# Altium schematic sheet saw_filter_pcb.SchDoc
size A4
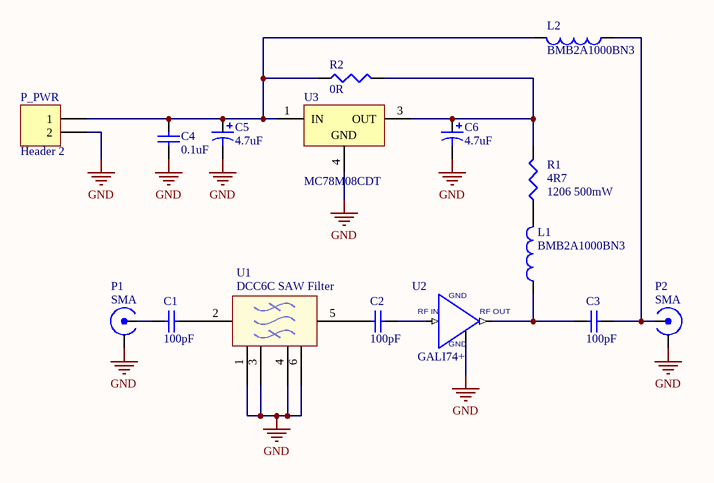
[diagram p0: saw_filter_pcb.SchDoc]

## Parts
C1  value 100pF  [1608[0603]]  (hidden comment: Cap Semi)
C2  value 100pF  [1608[0603]]  (hidden comment: Cap Semi)
C3  value 100pF  [1608[0603]]  (hidden comment: Cap Semi)
C4  value 0.1uF  [1608[0603]]  (hidden comment: Cap Semi)
C5  value 4.7uF  [C0805]  (hidden comment: Cap Pol3)
C6  value 4.7uF  [C0805]  (hidden comment: Cap Pol3)
L1  BMB2A1000BN3  [6-0805_N]
L2  BMB2A1000BN3  [6-0805_N]
P1  value SMA  [SMA_EDGE]  (hidden comment: SMA Con)
P2  value SMA  [SMA_EDGE]  (hidden comment: SMA Con)
P_PWR  Header 2  [HDR1X2]
R1  1206 500mW  value 4R7  [C1206]
R2  value 0R  [J1-0603]  (hidden comment: Res3)
U1  DCC6C SAW Filter  [DCC6C]
U2  GALI74+  [DF782]
U3  MC78M08CDT  [MP04A_N]

## Nets
GND: C4.1 C5.2 C6.2 P1.2 P2.2 P_PWR.2 U1.1(IN) U1.3(IN) U1.4(IN) U1.6(IN) U2.2(GND) U3.4(GND)
NetC1_1: C1.1 P1.1
NetC1_2: C1.2 U1.2(IN)
NetC2_1: C2.1 U1.5
NetC2_2: C2.2 U2.1(RF-IN)
NetC3_1: C3.1 L1.1 U2.3(RF-OUT)
NetC3_2: C3.2 L2.1 P2.1
NetC4_2: C4.2 C5.1 L2.2 P_PWR.1 R2.1 U3.1(IN)
NetC6_1: C6.1 R1.2 R2.2 U3.3(OUT)
NetL1_2: L1.2 R1.1

## Notes on the sheet
- (in symbol GALI74+) RF IN; RF OUT

## Library data of the parts
C1-C4 = Cap Semi: Capacitor (Semiconductor SIM Model); Published: 8-Jun-2000; LatestRevisionDate: 29-May-2009; LatestRevisionNote: IPC-7351 Footprint Added.; PackageReference: C1206; Publisher: Altium Limited; PackageDescription: Chip Capacitor
C5 C6 = Cap Pol3: Polarized Capacitor (Surface Mount); Published: 8-Jun-2000; LatestRevisionDate: 29-May-2009; LatestRevisionNote: IPC-7351 Footprint Added.; PackageReference: C0805; Publisher: Altium Limited; PackageDescription: Chip Capacitor
L1 L2 = Inductor: Code_IEC: 1005; Value: 100mH; Published: 8-Jun-2000; LatestRevisionDate: 29-May-2009; LatestRevisionNote: IPC-7351 Footprint Added.; PackageReference: 0402-A; Publisher: Altium Limited; PackageDescription: Chip Inductor; Code_JEITA: 0402
P1 P2 = SMA Con: Power Connector
P_PWR = Header 2: Header, 2-Pin; LatestRevisionDate: 17-Jul-2002; LatestRevisionNote: Re-released for DXP Platform.; Publisher: Altium Limited
R1 R2 = Res3: Resistor; Published: 8-Jun-2000; LatestRevisionDate: 29-May-2009; LatestRevisionNote: IPC-7351 Footprint Added.; PackageReference: J1-0603; Publisher: Altium Limited; PackageDescription: Chip Resistor
U3 = MC78M08CDT: Three-Terminal Medium Current Positive Voltage Regulator; Note: Pin 2 is electrically connected to Pin 4; Pin 2 is trimmed and not drawn;; Published: 15-Apr-2002; DatasheetVersion: Apr-2000; PackageVersion: 1997; PackageReference: 369A-13; Publisher: Altium Limited; PackageDescription: D-PAK/TO-252-AA; 3 Leads (1 Cropped); Body 10.3 (inc. leads) x 6.7 mm (LxW max); ComponentLink1Description: Manufacturer Link; ComponentLink1URL: http://www.onsemi.com/site/products/taxonomy/0,4438,503,00.html; ComponentLink2Description: Datasheet; ComponentLink2URL: http://www.onsemi.com/pub/Collateral/MC78M00-D.PDF
U2 = GALI74+: Value: GALI74+